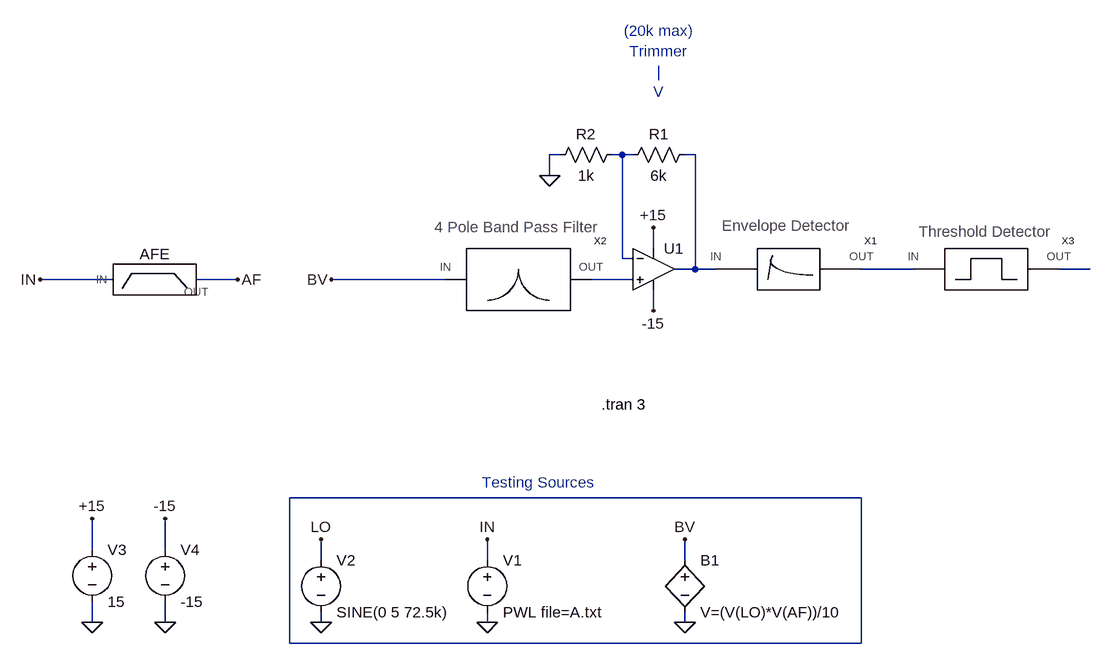
[diagram p0: schematic Acoustics System.asc]
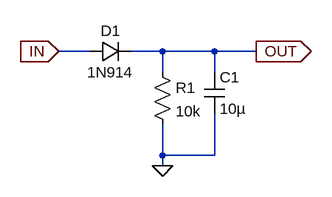
[diagram p1: sub-circuit envelopedetector.asc]
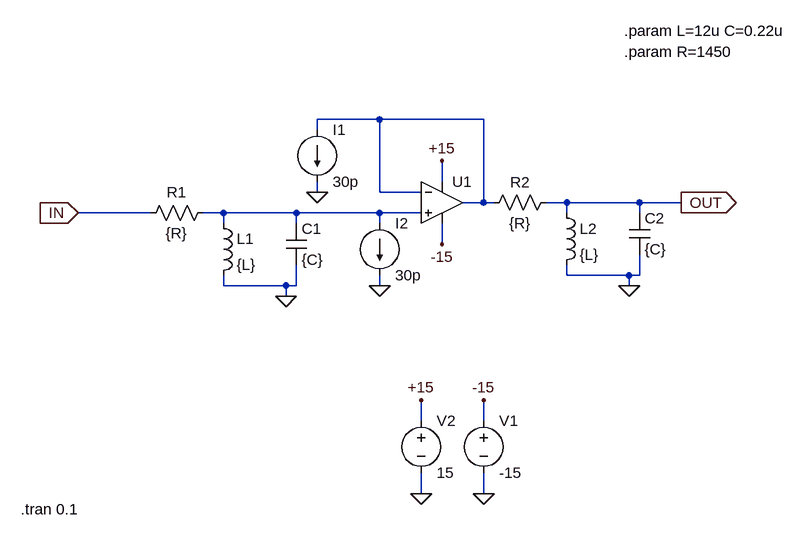
[diagram p2: sub-circuit 4p_bp_filter.asc]
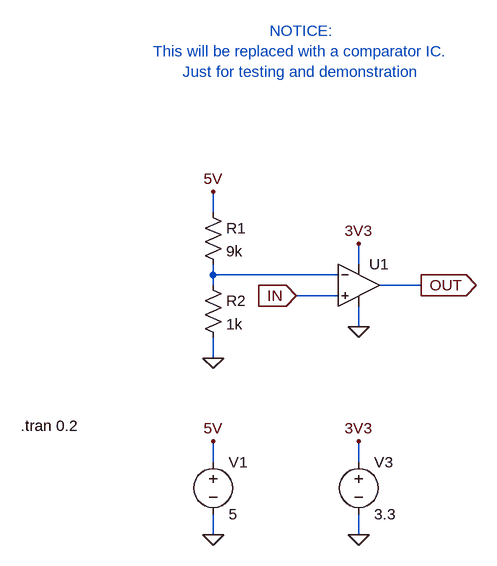
[diagram p3: sub-circuit thresholddetector.asc]
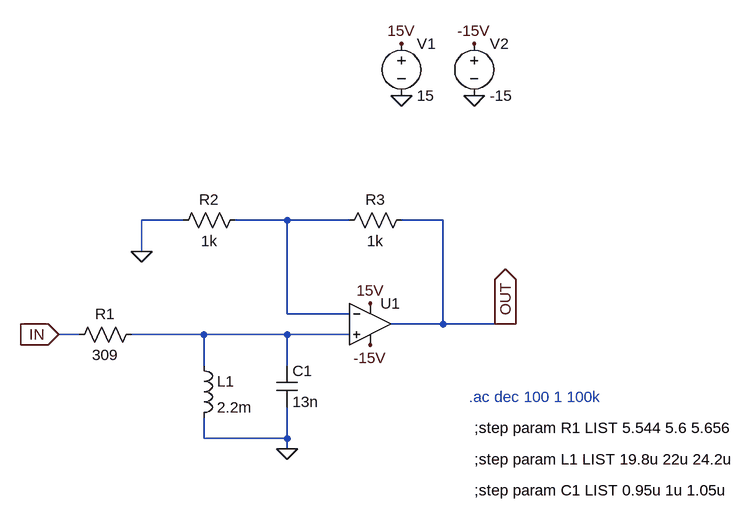
[diagram p4: sub-circuit afe_bandpass_v3.asc]
Acoustics System.asc, the LTspice schematic file:
Version 4
SHEET 1 880 696
WIRE -80 -64 -96 -64
WIRE 16 -64 0 -64
WIRE 32 -64 16 -64
WIRE 128 -64 112 -64
WIRE -96 -32 -96 -64
WIRE 64 80 64 48
WIRE 16 96 16 -64
WIRE 32 96 16 96
WIRE 128 112 128 -64
WIRE 128 112 96 112
WIRE 160 112 128 112
WIRE 464 112 384 112
WIRE 736 112 688 112
WIRE -768 128 -880 128
WIRE -576 128 -640 128
WIRE -256 128 -432 128
WIRE 32 128 -32 128
WIRE 64 176 64 144
WIRE 384 464 -496 464
WIRE -800 544 -800 496
WIRE -688 544 -688 496
WIRE -448 560 -448 528
WIRE -192 560 -192 528
WIRE 112 560 112 528
WIRE -800 656 -800 624
WIRE -688 656 -688 624
WIRE -448 656 -448 640
WIRE -192 656 -192 640
WIRE 112 656 112 640
WIRE -496 688 -496 464
WIRE 384 688 384 464
WIRE 384 688 -496 688
FLAG 112 656 0
FLAG -192 656 0
FLAG -448 656 0
FLAG -448 528 LO
FLAG -192 528 IN
FLAG -800 496 +15
FLAG -688 496 -15
FLAG -688 656 0
FLAG -800 656 0
FLAG 64 48 +15
FLAG 64 176 -15
FLAG -96 -32 0
FLAG 112 528 BV
FLAG -432 128 BV
FLAG -576 128 AF
FLAG -880 128 IN
SYMBOL envelopeDetector 256 128 R0
SYMATTR InstName X1
SYMBOL 4P_BP_Filter -192 144 R0
SYMATTR InstName X2
SYMBOL bv 112 544 R0
SYMATTR InstName B1
SYMATTR Value V=(V(LO)*V(AF))/10
SYMBOL voltage -192 544 R0
WINDOW 123 0 0 Left 0
WINDOW 39 0 0 Left 0
SYMATTR InstName V1
SYMATTR Value PWL file=A.txt
SYMBOL voltage -448 544 R0
WINDOW 123 0 0 Left 0
WINDOW 39 0 0 Left 0
SYMATTR InstName V2
SYMATTR Value SINE(0 5 72.5k)
SYMBOL OpAmps\\UniversalOpAmp 64 112 R0
SYMATTR InstName U1
SYMATTR Value2 Avol=1Meg GBW=5Meg Slew=12Meg Vos=3m
SYMBOL voltage -800 528 R0
WINDOW 123 0 0 Left 0
WINDOW 39 0 0 Left 0
SYMATTR InstName V3
SYMATTR Value 15
SYMBOL voltage -688 528 R0
WINDOW 123 0 0 Left 0
WINDOW 39 0 0 Left 0
SYMATTR InstName V4
SYMATTR Value -15
SYMBOL res 128 -80 R90
WINDOW 0 0 56 VBottom 2
WINDOW 3 32 56 VTop 2
SYMATTR InstName R1
SYMATTR Value 6k
SYMBOL res 16 -80 R90
WINDOW 0 0 56 VBottom 2
WINDOW 3 32 56 VTop 2
SYMATTR InstName R2
SYMATTR Value 1k
SYMBOL thresholdDetector 576 112 R0
SYMATTR InstName X3
SYMBOL AFE_bandpass_v3 -704 128 R0
SYMATTR InstName AFE
TEXT -16 320 Left 2 !.tran 3
TEXT -200 440 Left 2 ;Testing Sources
TEXT 72 -208 Center 2 ;(20k max)\nTrimmer\n|\nV

envelopedetector.asc, the sub-circuit schematic file:
Version 4
SHEET 1 1284 680
WIRE 176 112 128 112
WIRE 288 112 240 112
WIRE 368 112 288 112
WIRE 432 112 368 112
WIRE 288 144 288 112
WIRE 368 144 368 112
WIRE 288 272 288 224
WIRE 368 272 368 208
WIRE 368 272 288 272
WIRE 288 288 288 272
FLAG 288 288 0
FLAG 128 112 IN
IOPIN 128 112 In
FLAG 432 112 OUT
IOPIN 432 112 Out
SYMBOL diode 176 128 R270
WINDOW 0 32 32 VTop 2
WINDOW 3 0 32 VBottom 2
SYMATTR InstName D1
SYMATTR Value 1N914
SYMBOL res 272 128 R0
SYMATTR InstName R1
SYMATTR Value 10k
SYMBOL cap 352 144 R0
SYMATTR InstName C1
SYMATTR Value 10µ

4p_bp_filter.asc, the sub-circuit schematic file:
Version 4
SHEET 1 880 680
WIRE 48 -80 -48 -80
WIRE 208 -80 48 -80
WIRE -48 -64 -48 -80
WIRE 144 16 144 -16
WIRE -48 32 -48 16
WIRE 48 32 48 -80
WIRE 112 32 48 32
WIRE 208 48 208 -80
WIRE 208 48 176 48
WIRE 224 48 208 48
WIRE 336 48 304 48
WIRE 448 48 336 48
WIRE 512 48 448 48
WIRE -304 64 -416 64
WIRE -192 64 -224 64
WIRE -80 64 -192 64
WIRE 48 64 -80 64
WIRE 112 64 48 64
WIRE 336 64 336 48
WIRE 448 64 448 48
WIRE -192 80 -192 64
WIRE -80 80 -80 64
WIRE 48 80 48 64
WIRE 144 112 144 80
WIRE 336 160 336 144
WIRE 432 160 336 160
WIRE 448 160 448 128
WIRE 448 160 432 160
WIRE -192 176 -192 160
WIRE -96 176 -192 176
WIRE -80 176 -80 144
WIRE -80 176 -96 176
WIRE 48 176 48 160
WIRE 432 176 432 160
WIRE -96 192 -96 176
WIRE 112 384 112 352
WIRE 208 384 208 352
WIRE 112 496 112 464
WIRE 208 496 208 464
FLAG 112 496 0
FLAG 208 496 0
FLAG 112 352 +15
FLAG 208 352 -15
FLAG 144 -16 +15
FLAG 144 112 -15
FLAG -96 192 0
FLAG 432 176 0
FLAG -48 32 0
FLAG 48 176 0
FLAG -416 64 IN
IOPIN -416 64 In
FLAG 512 48 OUT
IOPIN 512 48 Out
SYMBOL OpAmps\\UniversalOpamp2 144 48 R0
SYMATTR InstName U1
SYMATTR Value2 Avol=1Meg GBW=5Meg Slew=12Meg Vos=3m
SYMBOL voltage 208 368 R0
WINDOW 123 0 0 Left 0
WINDOW 39 0 0 Left 0
SYMATTR InstName V1
SYMATTR Value -15
SYMBOL voltage 112 368 R0
WINDOW 123 0 0 Left 0
WINDOW 39 0 0 Left 0
SYMATTR InstName V2
SYMATTR Value 15
SYMBOL res -208 48 R90
WINDOW 0 0 56 VBottom 2
WINDOW 3 32 56 VTop 2
SYMATTR InstName R1
SYMATTR Value {R}
SYMATTR SpiceLine tol=1 pwr=.25
SYMBOL cap -96 80 R0
SYMATTR InstName C1
SYMATTR Value {C}
SYMATTR SpiceLine V=16
SYMBOL ind -208 64 R0
SYMATTR InstName L1
SYMATTR Value {L}
SYMBOL res 320 32 R90
WINDOW 0 0 56 VBottom 2
WINDOW 3 32 56 VTop 2
SYMATTR InstName R2
SYMATTR Value {R}
SYMATTR SpiceLine tol=1 pwr=.25
SYMBOL cap 432 64 R0
SYMATTR InstName C2
SYMATTR Value {C}
SYMATTR SpiceLine V=16
SYMBOL ind 320 48 R0
SYMATTR InstName L2
SYMATTR Value {L}
SYMBOL current -48 -64 R0
WINDOW 123 0 0 Left 0
WINDOW 39 0 0 Left 0
SYMATTR InstName I1
SYMATTR Value 30p
SYMBOL current 48 80 R0
WINDOW 123 0 0 Left 0
WINDOW 39 0 0 Left 0
SYMATTR InstName I2
SYMATTR Value 30p
TEXT 424 -184 Left 2 !.param R=1450
TEXT 424 -216 Left 2 !.param L=12u C=0.22u
TEXT -504 520 Left 2 !.tran 0.1

thresholddetector.asc, the sub-circuit schematic file:
Version 4
SHEET 1 880 680
WIRE 16 16 16 -16
WIRE 240 96 240 64
WIRE 16 112 16 96
WIRE 208 112 16 112
WIRE 16 128 16 112
WIRE 336 128 272 128
WIRE 208 144 144 144
WIRE 240 192 240 160
WIRE 16 240 16 208
WIRE 16 400 16 368
WIRE 240 400 240 368
WIRE 16 512 16 480
WIRE 240 512 240 480
FLAG 16 512 0
FLAG 240 512 0
FLAG 16 368 5V
FLAG 16 -16 5V
FLAG 240 64 3V3
FLAG 240 368 3V3
FLAG 16 240 0
FLAG 144 144 IN
IOPIN 144 144 In
FLAG 336 128 OUT
IOPIN 336 128 Out
FLAG 240 192 0
SYMBOL res 0 0 R0
SYMATTR InstName R1
SYMATTR Value 9k
SYMBOL res 0 112 R0
SYMATTR InstName R2
SYMATTR Value 1k
SYMBOL voltage 16 384 R0
WINDOW 123 0 0 Left 0
WINDOW 39 0 0 Left 0
SYMATTR InstName V1
SYMATTR Value 5
SYMBOL voltage 240 384 R0
WINDOW 123 0 0 Left 0
WINDOW 39 0 0 Left 0
SYMATTR InstName V3
SYMATTR Value 3.3
SYMBOL OpAmps\\UniversalOpAmp2 240 128 R0
SYMATTR InstName U1
SYMATTR Value2 Avol=1Meg GBW=5Meg Slew=12Meg Vos=3m
TEXT -280 344 Left 2 !.tran 0.2
TEXT 152 -232 Center 2 ;NOTICE:\nThis will be replaced with a comparator IC.\nJust for testing and demonstration

afe_bandpass_v3.asc, the sub-circuit schematic file:
Version 4
SHEET 1 1364 680
WIRE 432 -64 368 -64
WIRE 592 -64 512 -64
WIRE 688 -64 592 -64
WIRE 832 -64 768 -64
WIRE 368 -16 368 -64
WIRE 592 80 592 -64
WIRE 688 80 592 80
WIRE 832 96 832 -64
WIRE 832 96 752 96
WIRE 928 96 832 96
WIRE 944 96 928 96
WIRE 272 112 240 112
WIRE 464 112 352 112
WIRE 592 112 464 112
WIRE 688 112 592 112
WIRE 464 160 464 112
WIRE 592 160 592 112
WIRE 464 272 464 240
WIRE 592 272 592 224
WIRE 592 272 464 272
WIRE 592 288 592 272
FLAG 592 288 0
FLAG 368 -16 0
FLAG 768 -256 0
FLAG 880 -256 0
FLAG 720 64 15V
FLAG 768 -336 15V
FLAG 880 -336 -15V
FLAG 720 128 -15V
FLAG 928 96 OUT
IOPIN 928 96 Out
FLAG 240 112 IN
IOPIN 240 112 In
SYMBOL res 368 96 R90
WINDOW 0 0 56 VBottom 2
WINDOW 3 32 56 VTop 2
SYMATTR InstName R1
SYMATTR Value 309
SYMBOL res 528 -80 R90
WINDOW 0 0 56 VBottom 2
WINDOW 3 32 56 VTop 2
SYMATTR InstName R2
SYMATTR Value 1k
SYMBOL res 784 -80 R90
WINDOW 0 0 56 VBottom 2
WINDOW 3 32 56 VTop 2
SYMATTR InstName R3
SYMATTR Value 1k
SYMBOL ind 448 144 R0
SYMATTR InstName L1
SYMATTR Value 2.2m
SYMBOL cap 576 160 R0
SYMATTR InstName C1
SYMATTR Value 13n
SYMBOL OpAmps\\UniversalOpAmp2 720 96 R0
SYMATTR InstName U1
SYMATTR Value2 Avol=1Meg GBW=5Meg Slew=12Meg Vos=3m
SYMBOL voltage 768 -352 R0
WINDOW 123 0 0 Left 0
WINDOW 39 0 0 Left 0
SYMATTR InstName V1
SYMATTR Value 15
SYMBOL voltage 880 -352 R0
WINDOW 123 0 0 Left 0
WINDOW 39 0 0 Left 0
SYMATTR InstName V2
SYMATTR Value -15
TEXT 872 208 Left 2 ;.ac dec 100 1 100k
TEXT 880 256 Left 2 !;step param R1 LIST 5.544 5.6 5.656
TEXT 880 304 Left 2 !;step param L1 LIST 19.8u 22u 24.2u
TEXT 880 352 Left 2 !;step param C1 LIST 0.95u 1u 1.05u

The netlist it stands for:
* Acoustics System.asc
XX1 N002 N003 envelopedetector
XX2 BV N005 4p_bp_filter
B1 BV 0 V=(V(LO)*V(AF))/10
V1 IN 0 PWL file=A.txt
V2 LO 0 SINE(0 5 72.5k)
XU1 N005 N001 +15 -15 N002 level1 Avol=1Meg GBW=5Meg Slew=12Meg Vos=3m En=0 Enk=0 In=0 Ink=0 Rin=500Meg  ; pins In+ In- V+ V- OUT
V3 +15 0 15
V4 -15 0 -15
R1 N002 N001 6k
R2 N001 0 1k
XX3 N003 N004 thresholddetector
XAFE AF IN afe_bandpass_v3

* block symbol definitions
.subckt envelopedetector IN OUT
D1 IN OUT 1N914
R1 OUT 0 10k
C1 OUT 0 10µ
.ends envelopedetector

.subckt 4p_bp_filter IN OUT
XU1 N002 N001 +15 -15 N001 level.2 Avol=1Meg GBW=5Meg Slew=12Meg Vos=3m ilimit=25m rail=0 Vos=0 phimargin=45 en=0 enk=0 in=0 ink=0 Rin=500Meg  ; pins IN+ IN- V+ V- OUT
V1 -15 0 -15
V2 +15 0 15
R1 N002 IN {R} tol=1 pwr=.25
C1 N002 0 {C} V=16
L1 N002 0 {L}
R2 OUT N001 {R} tol=1 pwr=.25
C2 OUT 0 {C} V=16
L2 OUT 0 {L}
I1 N001 0 30p
I2 N002 0 30p
.param R=1450
.param L=12u C=0.22u
.tran 0.1
.ends 4p_bp_filter

.subckt thresholddetector IN OUT
R1 5V N001 9k
R2 N001 0 1k
V1 5V 0 5
V3 3V3 0 3.3
XU1 IN N001 3V3 0 OUT level2 Avol=1Meg GBW=5Meg Slew=12Meg Vos=3m Ilimit=25m Rail=0 Vos=0 En=0 Enk=0 In=0 Ink=0 Rin=500Meg  ; pins In+ In- V+ V- OUT
.tran 0.2
* NOTICE:
* This will be replaced with a comparator IC.
* Just for testing and demonstration
.ends thresholddetector

.subckt afe_bandpass_v3 OUT IN
R1 N002 IN 309
R2 N001 0 1k
R3 OUT N001 1k
L1 N002 0 2.2m
C1 N002 0 13n
XU1 N002 N001 15V -15V OUT level2 Avol=1Meg GBW=5Meg Slew=12Meg Vos=3m Ilimit=25m Rail=0 Vos=0 En=0 Enk=0 In=0 Ink=0 Rin=500Meg  ; pins In+ In- V+ V- OUT
V1 15V 0 15
V2 -15V 0 -15
* .ac dec 100 1 100k
;step param R1 LIST 5.544 5.6 5.656
;step param L1 LIST 19.8u 22u 24.2u
;step param C1 LIST 0.95u 1u 1.05u
.ends afe_bandpass_v3

.model D D
.lib standard.dio
.tran 3
* Testing Sources
* (20k max)
* Trimmer
* |
* V
.lib UniversalOpamps2.sub
.lib UniversalOpAmp1.lib
.lib UniversalOpAmp2.lib
.backanno
.end